# EAGLE design Esquematico (EAGLE 7.5.0)
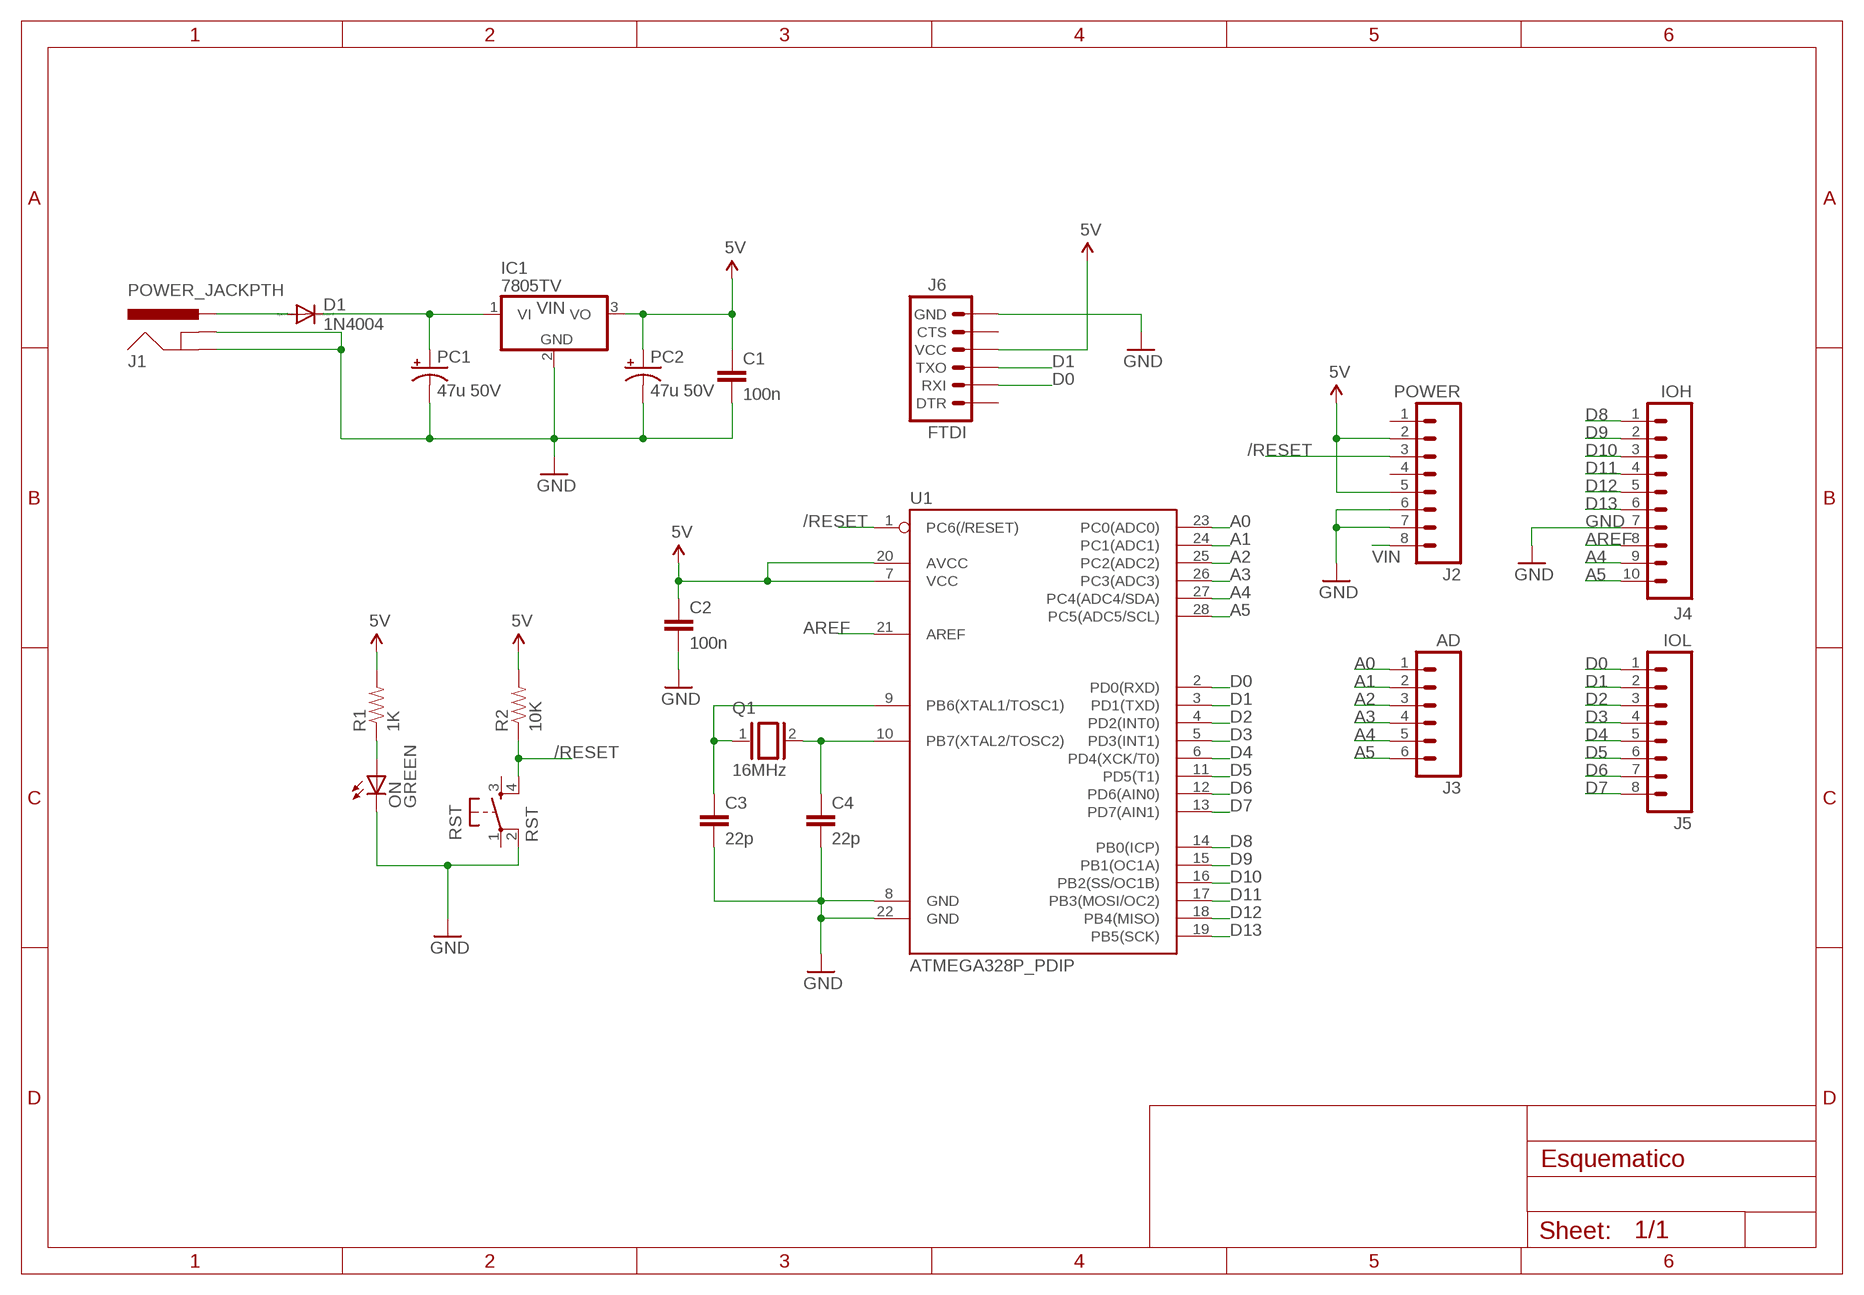
[diagram p0: schematic, sheet 1]

## Parts
C1  100n  C2,5-3  [C2.5-3]
C2  100n  CAPEZ  [CAP-PTH-SMALLEZ]
C3  22p  CAPEZ  [CAP-PTH-SMALLEZ]
C4  22p  CAPEZ  [CAP-PTH-SMALLEZ]
D1  1N4004  [DO41-10]
IC1  7805TV  [TO220V]
J1  POWER_JACKPTH  [POWER_JACK_PTH]
J2  POWER  M08NO_SILK  [1X08_PIN1_NO_SILK]
J3  AD  M06NO_SILK_FEMALE_PTH  [1X06_NO_SILK]
J4  IOH  M10NO_SILK_PTH_FEMALE  [1X10_NO_SILK]
J5  IOL  M08NO_SILK  [1X08_PIN1_NO_SILK]
J6  FTDI  ARDUINO_SERIAL_PROGRAMPTH  [1X06]
ON  GREEN  LED3MM  [LED3MM]
PC1  47u 50V  CPOL-USTAP5-50  [TAP5-50]
PC2  47u 50V  CPOL-USTAP5-50  [TAP5-50]
Q1  16MHz  XTAL/S  [QS]
R1  1K  1KOHM-1/4W-1%(PTH)  [AXIAL-0.3]
R2  10K  1KOHM-1/4W-1%(PTH)  [AXIAL-0.3]
RST  RST  TACTILE-SWITCH-PTH  [TAC-SWITCH-PTH]
U1  ATMEGA328P_PDIP  [DIL28-3]

## Nets
5V: C1.1 C2.1 IC1.3(VO) J2.2 J2.5 J6.4(VCC) PC2.+ R1.P$2 R2.P$2 U1.7(VCC) U1.20(AVCC)
/RESET: J2.3 R2.P$1 RST.4 U1.1(PC6(/RESET))
A0: J3.1 U1.23(PC0(ADC0))
A1: J3.2 U1.24(PC1(ADC1))
A2: J3.3 U1.25(PC2(ADC2))
A3: J3.4 U1.26(PC3(ADC3))
A4: J3.5 J4.9 U1.27(PC4(ADC4/SDA))
A5: J3.6 J4.10 U1.28(PC5(ADC5/SCL))
AREF: J4.8 U1.21(AREF)
D0: J5.1 J6.2(RXI) U1.2(PD0(RXD))
D1: J5.2 J6.3(TXO) U1.3(PD1(TXD))
D2: J5.3 U1.4(PD2(INT0))
D3: J5.4 U1.5(PD3(INT1))
D4: J5.5 U1.6(PD4(XCK/T0))
D5: J5.6 U1.11(PD5(T1))
D6: J5.7 U1.12(PD6(AIN0))
D7: J5.8 U1.13(PD7(AIN1))
D8: J4.1 U1.14(PB0(ICP))
D9: J4.2 U1.15(PB1(OC1A))
D10: J4.3 U1.16(PB2(SS/OC1B))
D11: J4.4 U1.17(PB3(MOSI/OC2))
D12: J4.5 U1.18(PB4(MISO))
D13: J4.6 U1.19(PB5(SCK))
GND: C1.2 C2.2 C3.2 C4.2 IC1.2(GND) J1.GND J1.GNDBREAK J2.6 J2.7 J4.7 J6.6(GND) ON.K(C) PC1.- PC2.- RST.2 U1.8(GND) U1.22(GND)
N$1: C4.1 Q1.2 U1.10(PB7(XTAL2/TOSC2))
N$3: ON.A R1.P$1
N$4: D1.A J1.PWR
VIN: D1.C IC1.1(VI) J2.8 PC1.+
XTAL1: C3.1 Q1.1 U1.9(PB6(XTAL1/TOSC1))
Unconnected: J2.1 J2.4 J6.1(DTR) J6.5(CTS) RST.1 RST.3

## Library data of the parts
C1 = capacitor-wima:C: CAPACITOR naming: grid - package width
C2-C4 = SparkFun-Capacitors:CAP: Capacitor Standard 0603 ceramic capacitor, and 0.1" leaded capacitor.
D1 = diode:1N4004: DIODE general purpose rectifier, 1 A
IC1 = linear:78*: Positive VOLTAGE REGULATOR Source: http://cache.national.com/ds/LM/LM78L05.pdf http://www.fairchildsemi.com/ds/LM/LM7805.pdf
J1 = SparkFun-Connectors:POWER_JACK: Power Jack This is the standard 5.5mm barrel jack for power. The PTH is the most common, proven, reliable, footprint. The Slot footprint only works if the mill layer is transmitted to the PCB fab house so be warned. Mating wall wart : TOL-00298 (and others); PROD_ID: CONN-08197
J2 J5 = SparkFun-Connectors:M08: Header 8 Standard 8-pin 0.1" header. Use with straight break away headers (SKU : PRT-00116), right angle break away headers (PRT-00553), swiss pins (PRT-00743), machine pins (PRT-00117), and female headers (PRT-00115).
J3 = SparkFun-Connectors:M06: Header 6 Standard 6-pin 0.1" header. Use with straight break away headers (SKU : PRT-00116), right angle break away headers (PRT-00553), swiss pins (PRT-00743), machine pins (PRT-00117), and female headers (PRT-00115). Molex polarized connector foot print use with SKU : PRT-08094 with associated crimp pins and housings. NOTES ON THE VARIANTS LOCK and LOCK_LONGPADS... This footprint was designed to help hold the alignment of a through-hole component (i.e. 6-pin header) while soldering it into place. You may notice that each hole has been shifted either up or down by 0.005 of an inch from it's more standard position (which is a perfectly straight line). This slight alteration caused the pins (the squares in the middle) to touch the edges of the holes. Because they are alternating, it causes a "brace" to hold the component in place. 0.005 has proven to be the perfect amount of "off-center" position when using our standard breakaway headers. Although looks a little odd when you look at the bare footprint, once you have a header in there, the alteration is very hard to notice. Also,if you push a header all the way into place, it is covered up entirely on the bottom side. This idea of altering the position of holes to aid alignment will be further integrated into the Sparkfun Library for other footprints. It can help hold any component with 3 or more connection pins.; PROD_ID: CONN-08437
J4 = SparkFun-Connectors:M10: Header 10 Standard 10-pin 0.1" header. Use with straight break away headers (SKU : PRT-00116), right angle break away headers (PRT-00553), swiss pins (PRT-00743), machine pins (PRT-00117), and female headers (PRT-00115).; PROD_ID: CONN-11563
J6 = SparkFun-Connectors:ARDUINO_SERIAL_PROGRAM: FTDI connector footprints
ON = led:LED: LED OSRAM: - CHIPLED LG R971, LG N971, LY N971, LG Q971, LY Q971, LO R971, LY R971 LH N974, LH R974 LS Q976, LO Q976, LY Q976 LO Q996 - Hyper CHIPLED LW Q18S LB Q993, LB Q99A, LB R99A - SideLED LS A670, LO A670, LY A670, LG A670, LP A670 LB A673, LV A673, LT A673, LW A673 LH A674 LY A675 LS A676, LA A676, LO A676, LY A676, LW A676 LS A679, LY A679, LG A679 - Hyper Micro SIDELED® LS Y876, LA Y876, LO Y876, LY Y876 LT Y87S - SmartLED LW L88C, LW L88S LB L89C, LB L89S, LG L890 LS L89K, LO L89K, LY L89K LS L896, LA L896, LO L896, LY L896 - TOPLED LS T670, LO T670, LY T670, LG T670, LP T670 LSG T670, LSP T670, LSY T670, LOP T670, LYG T670 LG T671, LOG T671, LSG T671 LB T673, LV T673, LT T673, LW T673 LH T674 LS T676, LA T676, LO T676, LY T676, LB T676, LH T676, LSB T676, LW T676 LB T67C, LV T67C, LT T67C, LS T67K, LO T67K, LY T67K, LW E67C LS E67B, LA E67B, LO E67B, LY E67B, LB E67C, LV E67C, LT E67C LW T67C LS T679, LY T679, LG T679 LS T770, LO T770, LY T770, LG T770, LP T770 LB T773, LV T773, LT T773, LW T773 LH T774 LS E675, LA E675, LY E675, LS T675 LS T776, LA T776, LO T776, LY T776, LB T776 LHGB T686 LT T68C, LB T68C - Hyper Mini TOPLED® LB M676 - Mini TOPLED Santana® LG M470 LS M47K, LO M47K, LY M47K Source: http://www.osram.convergy.de LUXEON: - LUMILED® LXK2-PW12-R00, LXK2-PW12-S00, LXK2-PW14-U00, LXK2-PW14-V00 LXK2-PM12-R00, LXK2-PM12-S00, LXK2-PM14-U00 LXK2-PE12-Q00, LXK2-PE12-R00, LXK2-PE12-S00, LXK2-PE14-T00, LXK2-PE14-U00 LXK2-PB12-K00, LXK2-PB12-L00, LXK2-PB12-M00, LXK2-PB14-N00, LXK2-PB14-P00, LXK2-PB14-Q00 LXK2-PR12-L00, LXK2-PR12-M00, LXK2-PR14-Q00, LXK2-PR14-R00 LXK2-PD12-Q00, LXK2-PD12-R00, LXK2-PD12-S00 LXK2-PH12-R00, LXK2-PH12-S00 LXK2-PL12-P00, LXK2-PL12-Q00, LXK2-PL12-R00 Source: www.luxeon.com KINGBRIGHT: KA-3528ASYC Source: www.kingbright.com
PC1 PC2 = rcl:CPOL-US: POLARIZED CAPACITOR, American symbol
Q1 = special:XTAL/S: CRYSTAL
R1 = SparkFun-Resistors:1KOHM-1/4W-1%(PTH): RES-12182; PROD_ID: RES-12182
R2 = SparkFun-Resistors:1KOHM-1/4W-1%(PTH): RES-12182; PROD_ID: RES-12182; VALUE: 1K
RST = GeekAmmo:TACTILE-SWITCH: Tactile Switch 4 Pins, SPST NO
U1 = SparkFun-DigitalIC:ATMEGA328P_PDIP: uC used in the Arduino 32kb flash, 1k EEPROM, 2k SRAM This is the through-hole version of this chip.

## Board
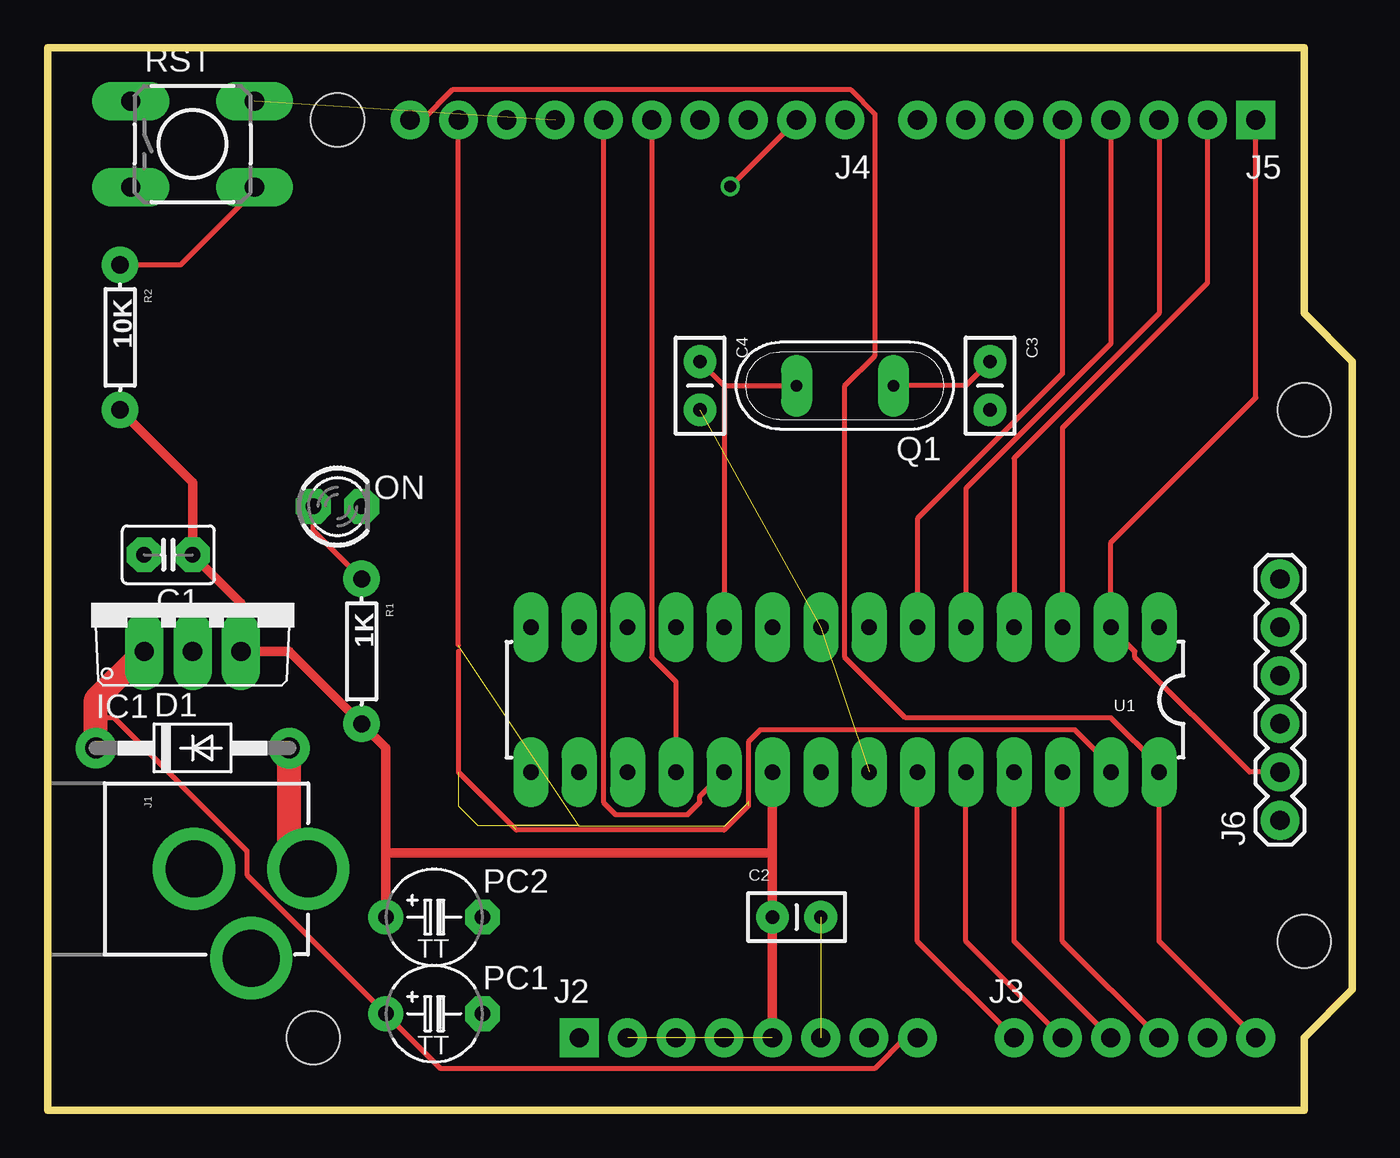
[diagram p1: board, top side]
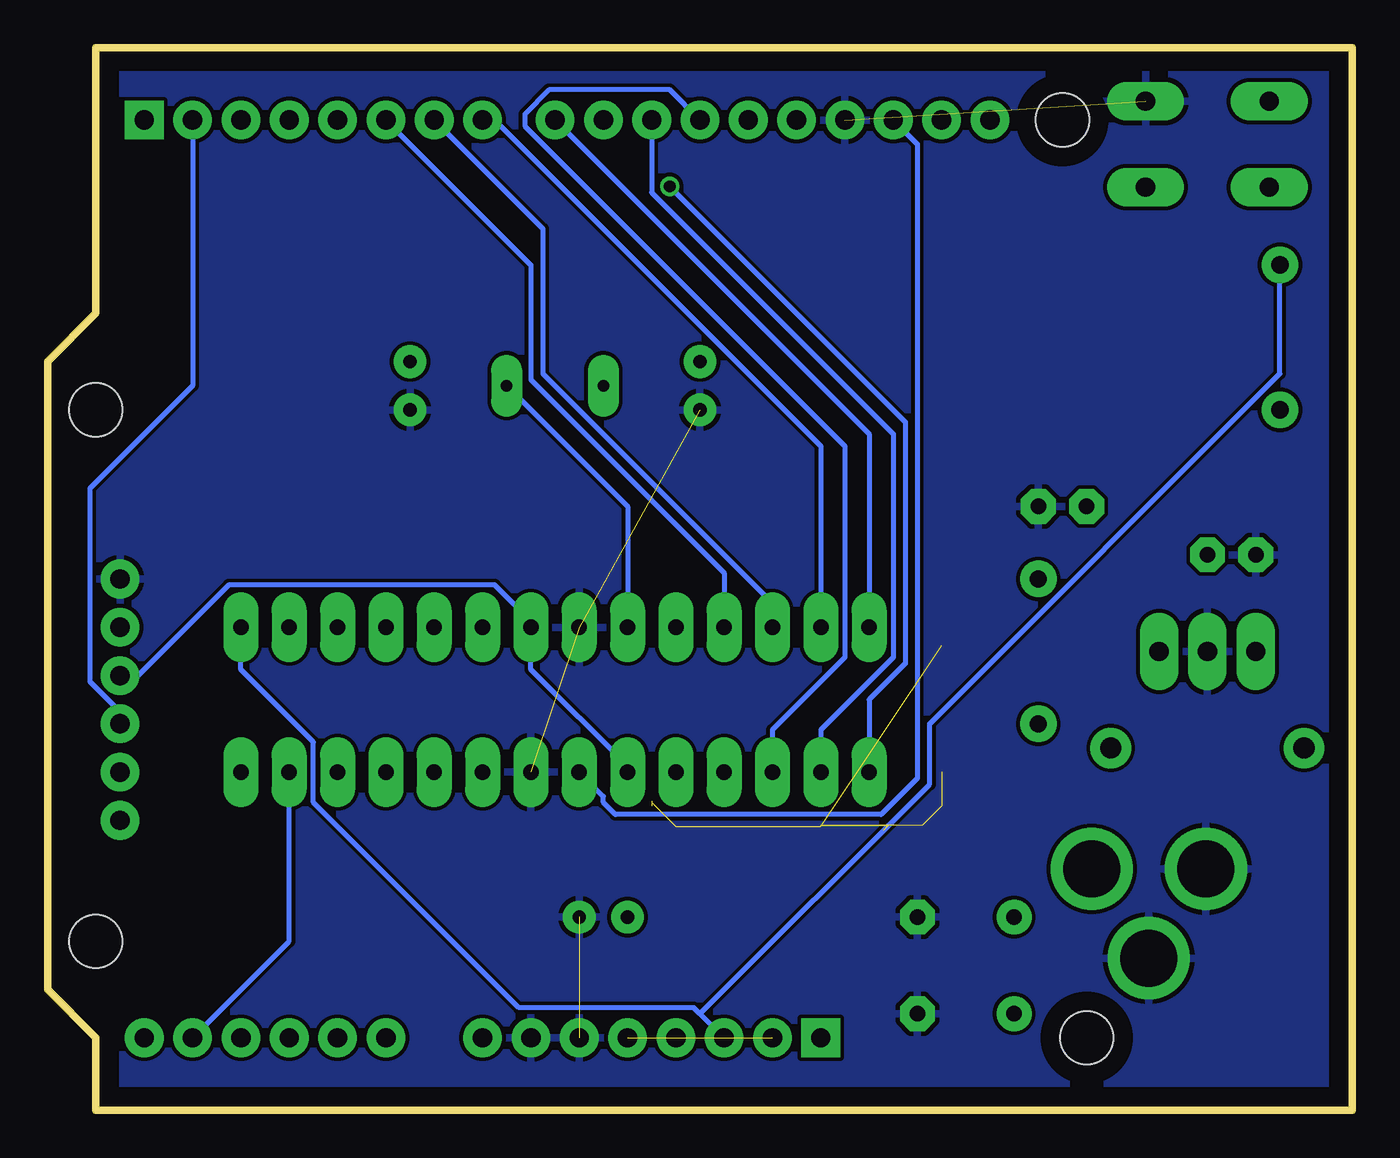
[diagram p2: board, bottom side, seen from below]

Size 68.58 x 55.88 mm. Coordinates in mm from the lower left corner, seen from the top.
Outline: 0,0 0,55.88 66.04,55.88 66.04,41.91 68.58,39.37 68.58,6.35 66.04,3.81 66.04,0 0,0
Copper layers (1*16): Top 0.035mm / dielectric 1.5mm / Bottom 0.035mm
Design rules "default *": minimum track width 10mil, minimum drill 24mil, track to track 8mil, track to pad 8mil, pad to pad 8mil, via to via 8mil, smd to smd 8mil, copper to edge 40mil, drill to drill 8mil, minimum pad ring 20mil, minimum via ring 8mil, stop-mask expansion 4mil, vias tented up to drill 0mil, thermal gap 10mil
Holes 2.8 mm at 15.24,52.07 13.97,3.81 66.04,8.89 66.04,36.83

### Footprints (pad centres in the part's own frame; a part is rotated, then mirrored left to right if it is on the bottom)
C2.5-3 = drill 0.813 pad 1.6 octagon: 1 -1.27,0; 2 1.27,0
CAP-PTH-SMALLEZ = drill 0.7 pad 1.651: 1 0,0; 2 2.54,0
DO41-10 = drill 1.118: A 5.08,0; C -5.08,0
TO220V = drill 1.016 long: 1 -2.54,-2.54; 2 0,-2.54; 3 2.54,-2.54
POWER_JACK_PTH = drill 2.997 pad 4.318: GND 0,7.7; GNDBREAK 4.7,10.7; PWR 0,13.7
1X08_PIN1_NO_SILK = drill 1.016 pad 1.88 square: 1 0,0 | drill 1.016 pad 1.88: 2 2.54,0; 3 5.08,0; 4 7.62,0; 5 10.16,0; 6 12.7,0; 7 15.24,0; 8 17.78,0
1X06_NO_SILK = drill 1.016 pad 1.88: 1 0,0; 2 2.54,0; 3 5.08,0; 4 7.62,0; 5 10.16,0; 6 12.7,0
1X10_NO_SILK = drill 1.016 pad 1.88: 1 0,0; 2 2.54,0; 3 5.08,0; 4 7.62,0; 5 10.16,0; 6 12.7,0; 7 15.24,0; 8 17.78,0; 9 20.32,0; 10 22.86,0
1X06 = drill 1.016 pad 1.88: 1 0,0; 2 2.54,0; 3 5.08,0; 4 7.62,0; 5 10.16,0; 6 12.7,0
LED3MM = drill 0.813 octagon: A -1.27,0; K 1.27,0
TAP5-50 = drill 0.813: + -2.54,0 | drill 0.813 octagon: - 2.54,0
QS = drill 0.61 long: 1 -2.54,0; 2 2.54,0
AXIAL-0.3 = drill 0.9 pad 1.88: P$1 -3.81,0; P$2 3.81,0
TAC-SWITCH-PTH = drill 1.016 pad 1.524 long: 1 -3.251,2.261; 2 3.251,2.261; 3 -3.251,-2.261; 4 3.251,-2.261
DIL28-3 = drill 0.813 long: 1 -16.51,-3.81; 2 -13.97,-3.81; 3 -11.43,-3.81; 4 -8.89,-3.81; 5 -6.35,-3.81; 6 -3.81,-3.81; 7 -1.27,-3.81; 8 1.27,-3.81; 9 3.81,-3.81; 10 6.35,-3.81; 11 8.89,-3.81; 12 11.43,-3.81; 13 13.97,-3.81; 14 16.51,-3.81; 15 16.51,3.81; 16 13.97,3.81; 17 11.43,3.81; 18 8.89,3.81; 19 6.35,3.81; 20 3.81,3.81; 21 1.27,3.81; 22 -1.27,3.81; 23 -3.81,3.81; 24 -6.35,3.81; 25 -8.89,3.81; 26 -11.43,3.81; 27 -13.97,3.81; 28 -16.51,3.81

### Placement (x,y rotation side)
C1  6.35,29.21 180 top
C2  38.1,10.16 0 top
C3  49.53,39.37 270 top
C4  34.29,39.37 270 top
D1  7.62,19.05 0 top
IC1  7.62,26.67 0 top
J1  0,12.7 270 top
J2  27.94,3.81 0 top
J3  50.8,3.81 0 top
J4  41.91,52.07 180 top
J5  63.5,52.07 180 top
J6  64.77,15.24 90 top
ON  15.24,31.75 0 top
PC1  20.32,5.08 0 top
PC2  20.32,10.16 0 top
Q1  41.91,38.1 180 top
R1  16.51,24.13 270 top
R2  3.81,40.64 270 top
RST  7.62,50.8 0 top
U1  41.91,21.59 180 top

### Tracks (layer width: path | path; a pad name or v marks a point on that pad's centre or on a via)
5V  (1 unrouted)
  Top 0.254: 38.1,12.7 38.1,13.53
  Top 0.508: R2.P$2 7.62,33.02 C1.1 10.16,26.67 IC1.3 12.7,24.13 R1.P$2 17.78,19.05 17.78,13.53 | 17.78,13.53 PC2.+ | 38.1,13.53 U1.20 | 38.1,13.53 17.78,13.53 | 38.1,13.53 C2.1 J2.5
  Bottom 0.254: U1.20 38.1,18.1 43.18,23.18 U1.7 43.18,25.72 45.09,27.62 59.05,27.62 63.82,22.86 J6.4
/RESET
  Top 0.254: R2.P$1 6.99,44.45 10.79,48.26 RST.4
  Bottom 0.254: U1.1 58.42,23.18 54.61,19.37 54.61,16.19 43.81,5.4 34.61,5.4 34.29,5.08 | J2.3 34.29,5.08 | R2.P$1 3.81,38.74 22.23,20.32 22.23,17.14 34.29,5.08
A0
  Top 0.254: U1.23 45.72,8.89 J3.1
A1
  Top 0.254: U1.24 48.26,8.89 J3.2
A2
  Top 0.254: U1.25 50.8,8.89 J3.3
A3
  Top 0.254: U1.26 53.34,8.89 J3.4
A4  (10 unrouted)
  Top 0.254: 21.59,24.45 J4.9 | U1.27 55.88,18.1 53.98,20 37.47,20 36.83,19.37 36.83,16 35.56,14.73 24.64,14.73 21.59,17.78 21.59,24.13
  Bottom 0.254: U1.27 55.88,8.89 J3.5
A5
  Top 0.254: J3.6 58.42,8.89 U1.28 58.42,18.1 55.88,20.64 45.09,20.64 41.91,23.81 41.91,38.1 43.5,39.69 43.5,52.39 42.23,53.66 21.27,53.66 19.68,52.07 J4.10
AREF
  Bottom 0.254: U1.21 39.37,16.51 39.37,16.19 38.73,15.56 24.77,15.56 22.86,17.46 22.86,50.8 J4.8
D0
  Top 0.254: J6.2 63.18,17.78 57.15,23.81 57.15,24.13 U1.2 55.88,29.84 63.5,37.47 J5.1
D1
  Top 0.254: U1.3 53.34,35.88 60.96,43.5 J5.2
  Bottom 0.254: J6.3 64.77,20.95 66.36,22.54 66.36,32.7 60.96,38.1 J5.2
D2
  Top 0.254: U1.4 50.8,34.29 58.42,41.91 J5.3
D3
  Top 0.254: U1.5 48.26,32.7 55.88,40.32 J5.4
D4
  Top 0.254: U1.6 45.72,31.11 53.34,38.74 J5.5
D5
  Bottom 0.254: U1.11 33.02,28.26 43.18,38.42 43.18,44.45 J5.6
D6
  Bottom 0.254: U1.12 30.48,26.67 42.55,38.74 42.55,46.36 J5.7
D7
  Bottom 0.254: U1.13 27.94,34.93 45.09,52.07 J5.8
D8
  Bottom 0.254: U1.14 25.4,35.56 J4.1
D9  (via drill 0.61)
  Top 0.254: J4.2 v35.88,48.58
  Bottom 0.254: U1.15 25.4,21.59 23.5,23.5 23.5,36.2 v35.88,48.58
D10
  Bottom 0.254: U1.16 27.94,20 24.13,23.81 24.13,35.56 36.83,48.26 J4.3
D11
  Bottom 0.254: U1.17 30.48,20 26.67,23.81 26.67,34.93 43.5,51.75 43.5,52.39 42.23,53.66 35.88,53.66 J4.4
D12
  Top 0.254: U1.18 33.02,22.54 31.75,23.81 J4.5
D13
  Top 0.254: U1.19 34.29,16.51 34.29,16.19 33.66,15.56 29.84,15.56 29.21,16.19 J4.6
GND  (4 unrouted)
  pour Bottom: 0,55.88 0,0 66.04,0 66.04,3.81 68.58,6.35 68.58,39.37 66.04,41.91 66.04,55.88
N$1
  Top 0.254: 35.56,38.1 Q1.2 | C4.1 35.56,38.1 | 35.56,38.1 U1.10
N$3
  Top 0.254: ON.A 13.97,30.48 R1.P$1
N$4
  Top 0.254: 13.81,12.86 13.65,12.7 J1.PWR
  Top 1.27: 13.97,12.7 13.81,12.86 12.7,13.97 D1.A
VIN
  Top 0.254: 2.54,20.64 3.49,20.64 10.48,13.65 10.48,12.38 PC1.+ 20.64,2.22 43.5,2.22 45.09,3.81 J2.8
  Top 1.27: D1.C 2.54,20.64 2.54,21.59 IC1.1
XTAL1
  Top 0.254: Q1.1 48.26,38.1 C3.1
  Bottom 0.254: U1.9 38.1,31.75 Q1.1